# Altium schematic sheet 60V_Ind.SchDoc
size Letter
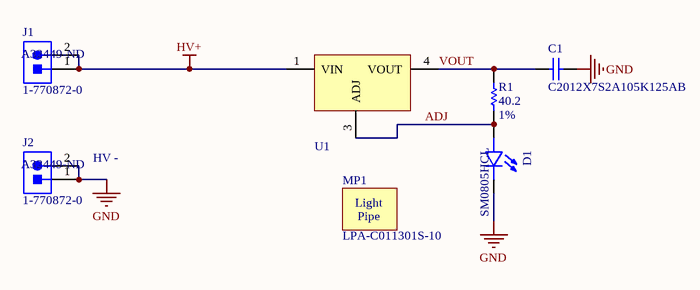
[diagram p0: 60V_Ind.SchDoc]

## Parts
C1  C2012X7S2A105K125AB  [CAPC2013X145X20ML20]
D1  SM0805HCL  [LEDC2012X135N_SM0805UGC(Primary)]
J1  1-770872-0  Supplier Part Number 1: A32449-ND  [CON2_1X2_P163_VM]
J2  1-770872-0  Supplier Part Number 1: A32449-ND  [CON2_1X2_P163_VM]
MP1  LPA-C011301S-10  [LPA-C011301S-10]
R1  Val: 40.2  Tol: 1%  [0805_RES]  (hidden comment: 40.2 Ohms)
U1  LR8K4-G  [Microchip_C04-189_MFG]  (value not drawn)

## Nets
GND: C1.2 D1.C J2.1 J2.2
HV+: J1.1 J1.2 U1.1(VIN)
ADJ: D1.A R1.1 U1.3(ADJ)
VOUT: C1.1 R1.2 U1.4(VOUT)

## Notes on the sheet
- (near J2) HV -
- (in symbol LPA-C011301S-10) Light; Pipe

## Library data of the parts
C1 = CMP-2000-05454-1: Chip Capacitor, 1 uF, +/- 10%, 100 V, -55 to 125 degC, 0805 (2012 Metric), RoHS, Tape and Reel; PCN Part Number: MLCCPartNumberChange30/Nov/2012; Manufacturer: TDK; Other Names: 445-5205-1; Online Catalog: CSeries,MidVoltage; Capacitance: 1µF; Voltage - Rated: 100V; Temperature Coefficient: X7S; Featured Product: Compact,High-CapacitanceMultilayerCeramicChipCapacitorsMidVoltageX7S-100VMLCCsC-SeriesMidVoltageMLCCs; Kits: 445-9009-KIT-ND-KITCAPCERHICAP100V-630VSMDSAMPLEKIT1008-ND-KITCAPCERMLCC100V-630V; Catalog Drawings: CSERIES_2012-0805_1.45; Product Training Modules: SEAT,CCV,andTVCLDesignToolsCSeriesMidVoltageCapacitorsFamilyGuidetoReplacinganElectrolyticCapacitorwithanMLCC; Manufacturer URL: http://www.tdk.com/; Series: C; Ratings: -; Datasheet Version: Sep-13; Operating Temperature: -55degC~125degC; Lead Spacing: -; RoHS Information: RoHSCertificate-MLCC; Mounting Type: SurfaceMount,MLCC; Package Reference: 805; Thickness (Max): 0.053"(1.35mm); Category: Capacitors; Lead Style: -; Package Description: 2-Pin Surface Mount Device, Body 2 x 1.25 mm; Family: CeramicCapacitors; Features: -; Applications: GeneralPurpose; Package / Case: 0805(2012Metric); Standard Package: 1; Size / Dimension: 0.079"Lx0.049"W(2.00mmx1.25mm); Height - Seated (Max): -; Datasheet URL: https://datasheet.ciiva.com/24216/c2012x7s2a105k125ab-265082-24216433.pdf; Tolerance: ±10%; Packaging: CutTape(CT)
D1 = SM0805HCL: Red 631nm LED Indication - Discrete 1.9V 0805 (2012 Metric); Supplier 1: Digi-Key; Supplier Part Number 1: 492-2281-1-ND
J1 J2 = 1-770872-0: Connector Header Through Hole 2 position 0.163" (4.14mm); Vendor: TE Connectivity; Built_By: EMA_UL_Team; Manufacturer_Part_Number: 1-770872-0; Copyright: Copyright (C) 2018 Accelerated Designs. All rights reserved; RefDes: RefDes; Type: DEV; Value: Value; Supplier 1: Digi-Key
MP1 = LPA-C011301S-10: Light Pipe Single Clear Rigid Round with Flat Top, 3mm Board Mount, Press Fit; Supplier 1: Digi-Key; Supplier Part Number 1: 67-1833-ND
R1 = RES 0805 40.2 1%: Resistor Surface Mount, 40.2 Ohms, 0805 Footprint, 1% Tolerance 0.125W; Manufacturer: Various; PCB Package: 0805; Description in Visual: Res SMT 40.2 0805  1%  0.125W; Value: 40.2; P/N: RES 0805 40.2 1%; Manufacturer P/N: Various; Power_Rating: 0.125W; Tolerance: 1%
U1 = LR8K4-G: Linear Voltage Regulator IC Positive Adjustable 1 Output  10mA TO-252, (D-Pak); Supplier 1: Digi-Key; Supplier Part Number 1: LR8K4-GCT-ND